# Altium schematic sheet Demo Board 3 - Schematic.SchDoc
size A4; SheetNumber: 3; SheetTotal: 4
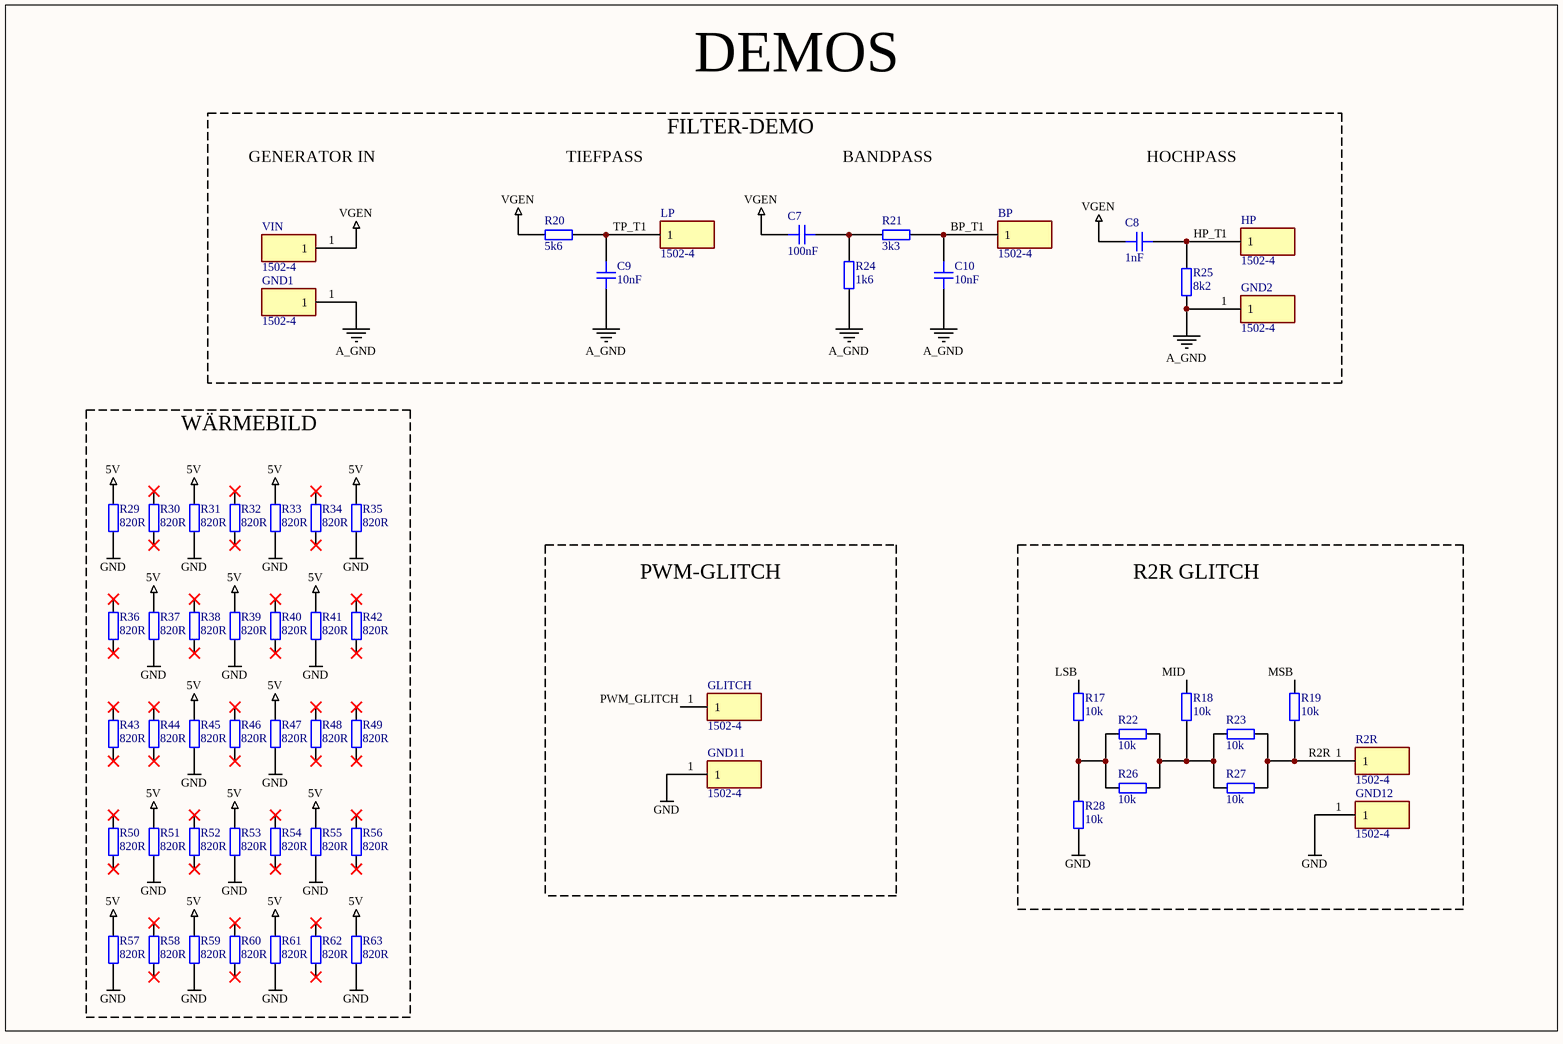
[diagram p0: Demo Board 3 - Schematic.SchDoc]

## Parts
BP  1502-4  [KEYSTONE_1502-4]
C7  100nF  [CAP_0603]
C8  1nF  [CAP_0603]
C9  10nF  [CAP_0603]
C10  10nF  [CAP_0603]
GLITCH  1502-4  [KEYSTONE_1502-4]
GND1  1502-4  [KEYSTONE_1502-4]
GND2  1502-4  [KEYSTONE_1502-4]
GND11  1502-4  [KEYSTONE_1502-4]
GND12  1502-4  [KEYSTONE_1502-4]
HP  1502-4  [KEYSTONE_1502-4]
LP  1502-4  [KEYSTONE_1502-4]
R2R  1502-4  [KEYSTONE_1502-4]
R17  10k  [RES_0603]
R18  10k  [RES_0603]
R19  10k  [RES_0603]
R20  5k6  [RES_0603]
R21  3k3  [RES_0603]
R22  10k  [RES_0603]
R23  10k  [RES_0603]
R24  1k6  [RES_0603]
R25  8k2  [RES_0603]
R26  10k  [RES_0603]
R27  10k  [RES_0603]
R28  10k  [RES_0603]
R29  820R  [RES_0603]
R30  820R  [RES_0603]
R31  820R  [RES_0603]
R32  820R  [RES_0603]
R33  820R  [RES_0603]
R34  820R  [RES_0603]
R35  820R  [RES_0603]
R36  820R  [RES_0603]
R37  820R  [RES_0603]
R38  820R  [RES_0603]
R39  820R  [RES_0603]
R40  820R  [RES_0603]
R41  820R  [RES_0603]
R42  820R  [RES_0603]
R43  820R  [RES_0603]
R44  820R  [RES_0603]
R45  820R  [RES_0603]
R46  820R  [RES_0603]
R47  820R  [RES_0603]
R48  820R  [RES_0603]
R49  820R  [RES_0603]
R50  820R  [RES_0603]
R51  820R  [RES_0603]
R52  820R  [RES_0603]
R53  820R  [RES_0603]
R54  820R  [RES_0603]
R55  820R  [RES_0603]
R56  820R  [RES_0603]
R57  820R  [RES_0603]
R58  820R  [RES_0603]
R59  820R  [RES_0603]
R60  820R  [RES_0603]
R61  820R  [RES_0603]
R62  820R  [RES_0603]
R63  820R  [RES_0603]
VIN  1502-4  [KEYSTONE_1502-4]

## Blocks framed on the sheet
FILTER-DEMO: BP C7-C10 GND1 GND2 HP LP R20 R21 R24 R25 VIN
WÄRMEBILD: R29-R63
PWM-GLITCH: GLITCH GND11
R2R GLITCH: GND12 R2R R17-R19 R22 R23 R26-R28

## Nets
5V: R29.2 R31.2 R33.2 R35.2 R37.2 R39.2 R41.2 R45.2 R47.2 R51.2 R53.2 R55.2 R57.2 R59.2 R61.2 R63.2
A_GND: C9.1 C10.2 GND1.1 GND2.1 R24.2 R25.2
GND: GND11.1 GND12.1 R28.1 R29.1 R31.1 R33.1 R35.1 R37.1 R39.1 R41.1 R45.1 R47.1 R51.1 R53.1 R55.1 R57.1 R59.1 R61.1 R63.1
VGEN: C7.2 C8.2 R20.2 VIN.1
BP_T: BP.1 C10.1 R21.2
HP_T: C8.1 HP.1 R25.1
LSB: R17.2
MID: R18.2
MSB: R19.2
PWM_GLITCH: GLITCH.1
R2R: R2R.1 R19.1 R23.1 R27.1
TP_T: C9.2 LP.1 R20.1
NetC7_1: C7.1 R21.1 R24.1
NetR17_1: R17.1 R22.2 R26.2 R28.2
NetR18_1: R18.1 R22.1 R23.2 R26.1 R27.2

Not connected (* = marked no-connect by the designer): R30 1* 2*; R32 1* 2*; R34 1* 2*; R36 1* 2*; R38 1* 2*; R40 1* 2*; R42 1* 2*; R43 1* 2*; R44 1* 2*; R46 1* 2*; R48 1* 2*; R49 1* 2*; R50 1* 2*; R52 1* 2*; R54 1* 2*; R56 1* 2*; R58 1* 2*; R60 1* 2*; R62 1* 2*

## Notes on the sheet
- DEMOS
- GENERATOR IN
- TIEFPASS
- BANDPASS
- HOCHPASS

## Library data of the parts
C7-C10 = CAP_0603: Capacitor SMD 0603; Manufacturer: *; Manufacturer Part Number: *; Distributor Link: *; LCSC: *; Rating: *; Dielectric: *
R17-R63 = RES_0603: Resistor SMD 0603; Manufacturer: *; Manufacturer Part Number: *; Distributor Link: *; LCSC: *
BP GLITCH GND1 GND2 GND11 GND12 HP LP R2R VIN = 1502-4: Package: None; Price: None; Value: *; MP: 1502-4; Availability: Unavailable